# Altium schematic sheet 2126_A_MainBoard_AffichageMatriciel.SchDoc
size A3; Author: Ricardo Crespo; Organization: ETML-ES; Address1: Avenue Recordon 1; Address2: 1004 Lausanne; Address3: Switzerland; Revision: A; SheetNumber: 1; SheetTotal: 1
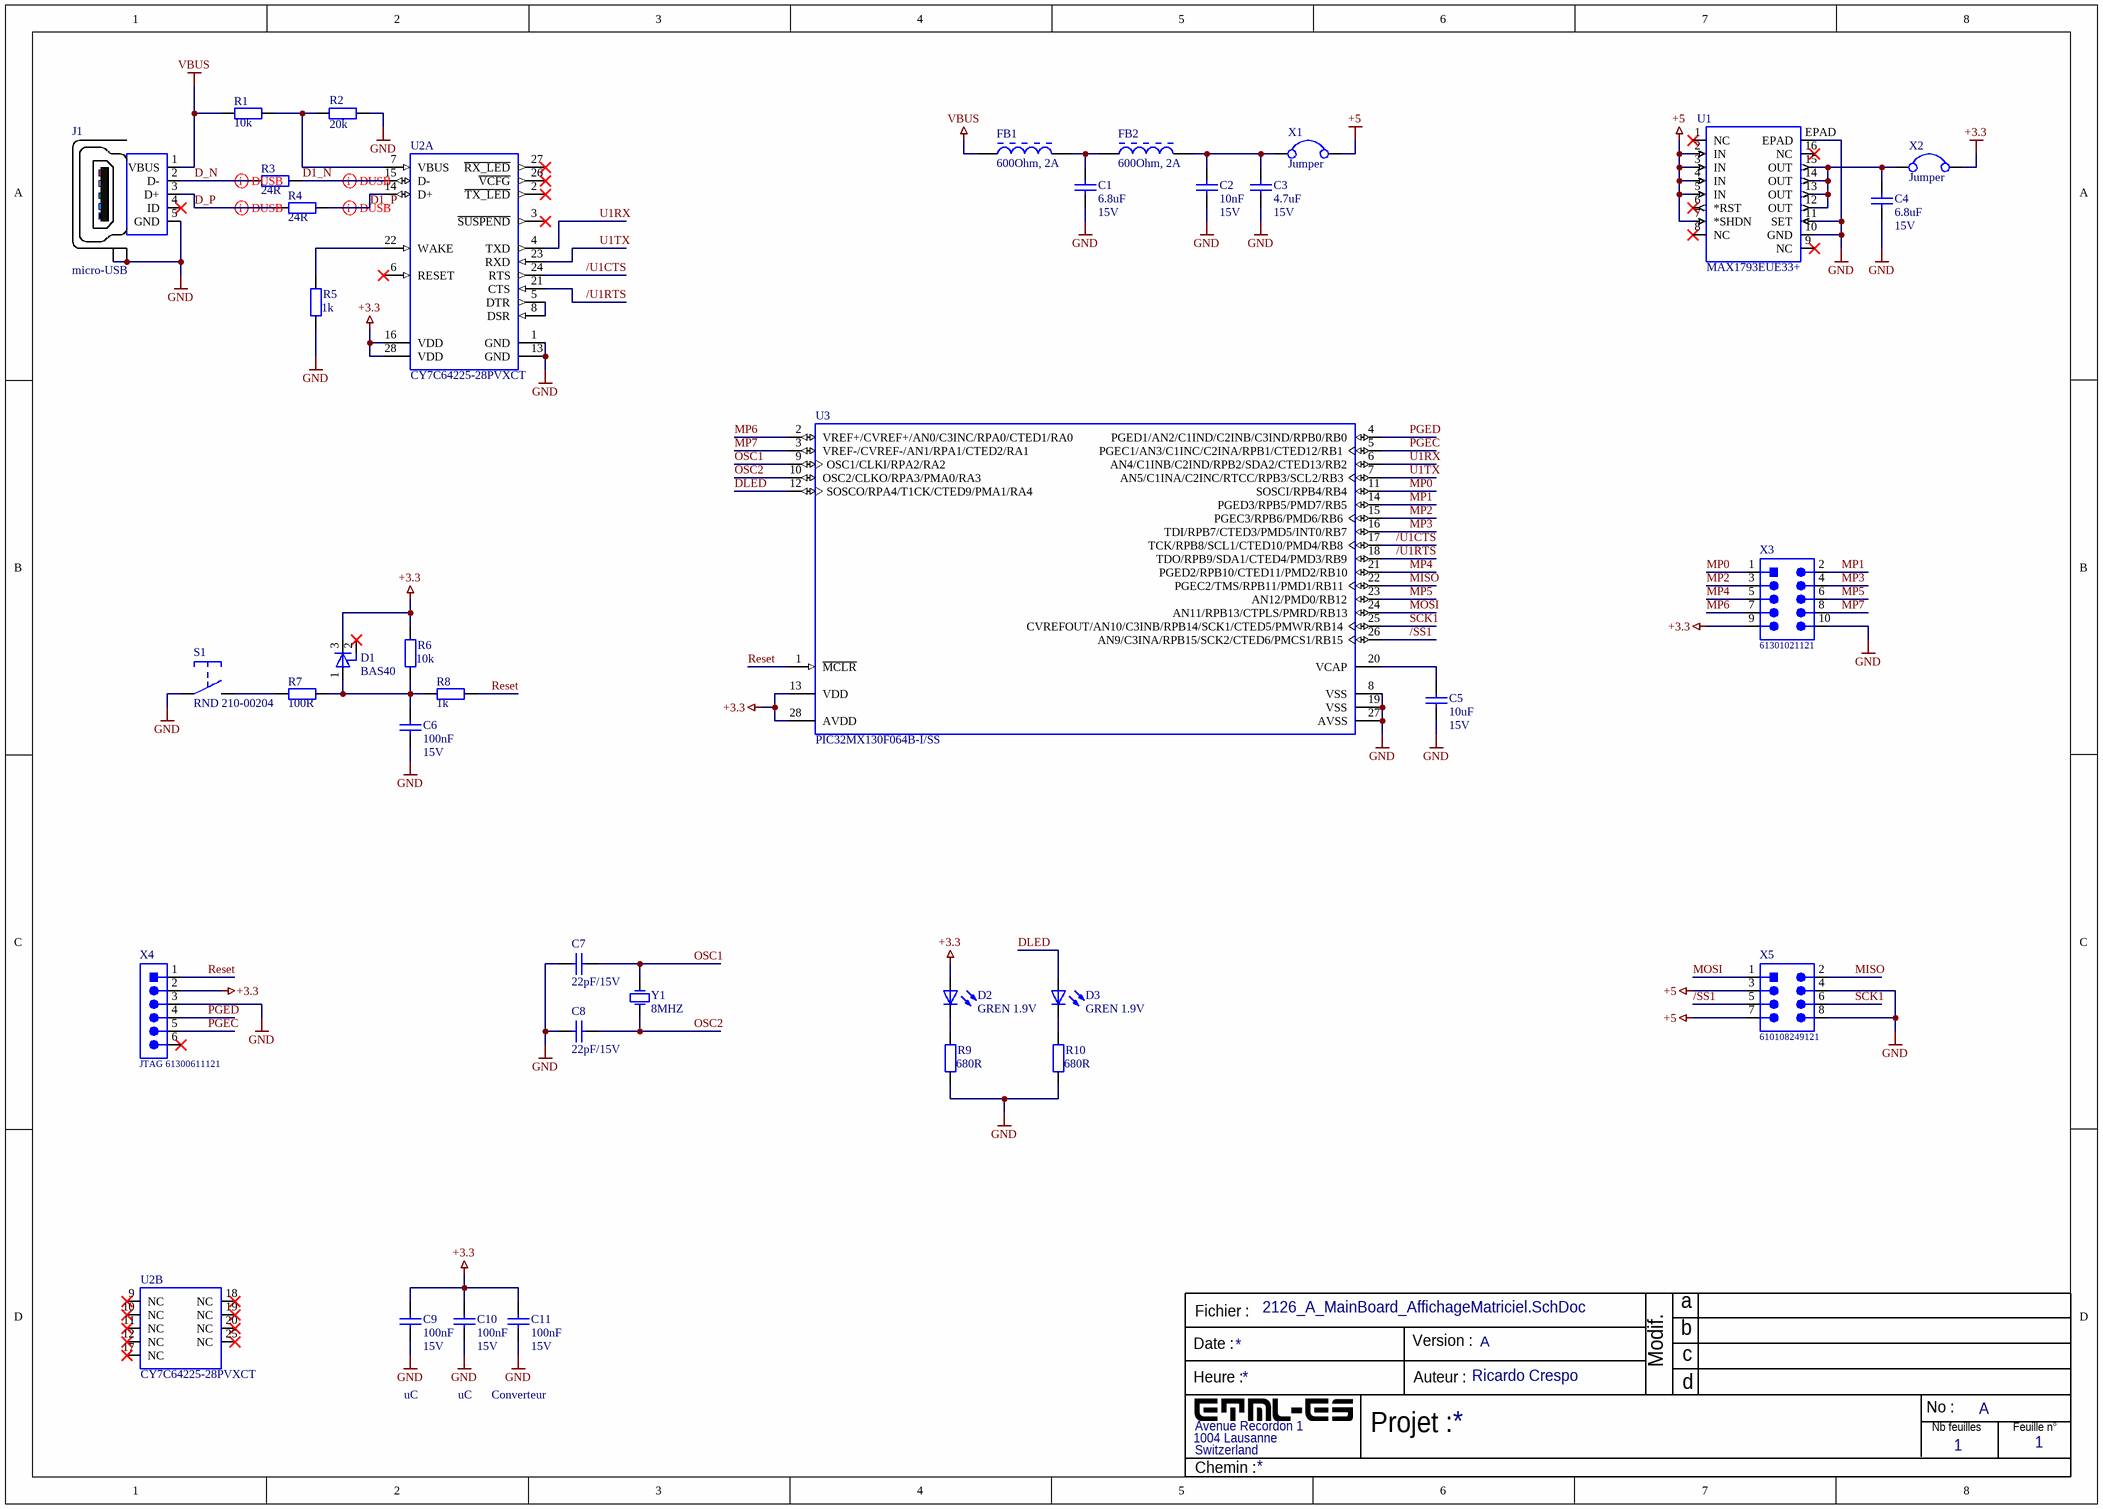
[diagram p0: 2126_A_MainBoard_AffichageMatriciel.SchDoc]

## Parts
C1  6.8uF  [CAPC2013X145X48NL20T23]
C2  10nF  [CAPC2013X145X48NL20T23]
C3  4.7uF  [CAPC2013X145X48NL20T23]
C4  6.8uF  [CAPC2013X145X48NL20T23]
C5  10uF  [CAPC2013X145X48NL20T23]
C6  100nF  [CAPC2013X145X48NL20T23]
C7  22pF/15V  [CAPC2013X145X48NL20T23]
C8  22pF/15V  [CAPC2013X145X48NL20T23]
C9  100nF  [CAPC2013X145X48NL20T23]
C10  100nF  [CAPC2013X145X48NL20T23]
C11  100nF  [CAPC2013X145X48NL20T23]
D1  BAS40  [INF-SOT23_N]
D2  GREN 1.9V  [LED_0805]
D3  GREN 1.9V  [LED_0805]
FB1  600Ohm, 2A  [WE-CBF_1206_High Speed]
FB2  600Ohm, 2A  [WE-CBF_1206_High Speed]
J1  micro-USB  [629105150521]
R1  10k  [RESC2013X70X40ML20T20]
R2  20k  [RESC2013X70X40ML20T20]
R3  24R  [RESC2013X70X40ML20T20]
R4  24R  [RESC2013X70X40ML20T20]
R5  1k  [RESC2013X70X40ML20T20]
R6  10k  [RESC2013X70X40ML20T20]
R7  100R  [RESC2013X70X40ML20T20]
R8  1k  [RESC2013X70X40ML20T20]
R9  680R  [RESC2013X70X40ML20T20]
R10  680R  [RESC2013X70X40ML20T20]
S1  RND 210-00204  [PushButton]
U1  MAX1793EUE33+  [TSOP65P640X110_HS-17N]
U2  CY7C64225-28PVXCT  [CYP-PVX28_N]  (parts A,B of 2)
U3  PIC32MX130F064B-I/SS  [MCHP-SSOP-SS28_N]
X1  Jumper  [61300211121]
X2  Jumper  [61300211121]
X3  61301021121  [61301021121]
X4  JTAG 61300611121  [61300611121]
X5  610108249121  [610108249121]
Y1  8MHZ  [LFXTAL003151REEL]

## Nets
+3.3: C9.2 C10.2 C11.2 D1.3(K) D2.A R6.2 U2.16(VDD) U2.28(VDD) U3.13(VDD) U3.28(AVDD) X2.2 X3.9 X4.2
+5: U1.2(IN) U1.3(IN) U1.4(IN) U1.5(IN) U1.7(*SHDN) X1.2 X5.3 X5.7
GND: C1.1 C2.1 C3.1 C4.1 C5.1 C6.1 C7.1 C8.1 C9.1 C10.1 C11.1 J1.5(GND) J1.Z1(Shield) J1.Z2(Shield) R2.1 R5.1 R9.1 R10.1 S1.1 U1.10(GND) U1.11(SET) U1.EPAD U2.1(GND) U2.13(GND) U3.8(VSS) U3.19(VSS) U3.27(AVSS) X3.10 X4.3 X5.4 X5.8
VBUS: FB1.1 J1.1(VBUS) R1.1
/SS1: U3.26(AN9/C3INA/RPB15/SCK2/CTED6/PMCS1/RB15) X5.5
/U1CTS: U2.24(RTS) U3.17(TCK/RPB8/SCL1/CTED10/PMD4/RB8)
/U1RTS: U2.21(CTS) U3.18(TDO/RPB9/SDA1/CTED4/PMD3/RB9)
D1_N: R3.2 U2.15(D-)
D1_P: R4.2 U2.14(D+)
D_N: J1.2(D-) R3.1
D_P: J1.3(D+) R4.1
DLED: D3.A U3.12(SOSCO/RPA4/T1CK/CTED9/PMA1/RA4)
MISO: U3.22(PGEC2/TMS/RPB11/PMD1/RB11) X5.2
MOSI: U3.24(AN11/RPB13/CTPLS/PMRD/RB13) X5.1
MP0: U3.11(SOSCI/RPB4/RB4) X3.1
MP1: U3.14(PGED3/RPB5/PMD7/RB5) X3.2
MP2: U3.15(PGEC3/RPB6/PMD6/RB6) X3.3
MP3: U3.16(TDI/RPB7/CTED3/PMD5/INT0/RB7) X3.4
MP4: U3.21(PGED2/RPB10/CTED11/PMD2/RB10) X3.5
MP5: U3.23(AN12/PMD0/RB12) X3.6
MP6: U3.2(VREF+/CVREF+/AN0/C3INC/RPA0/CTED1/RA0) X3.7
MP7: U3.3(VREF-/CVREF-/AN1/RPA1/CTED2/RA1) X3.8
OSC1: C7.2 U3.9(OSC1/CLKI/RPA2/RA2) Y1.1
OSC2: C8.2 U3.10(OSC2/CLKO/RPA3/PMA0/RA3) Y1.2
PGEC: U3.5(PGEC1/AN3/C1INC/C2INA/RPB1/CTED12/RB1) X4.5
PGED: U3.4(PGED1/AN2/C1IND/C2INB/C3IND/RPB0/RB0) X4.4
Reset: R8.2 U3.1(~{MCLR}) X4.1
SCK1: U3.25(CVREFOUT/AN10/C3INB/RPB14/SCK1/CTED5/PMWR/RB14) X5.6
U1RX: U2.4(TXD) U3.6(AN4/C1INB/C2IND/RPB2/SDA2/CTED13/RB2)
U1TX: U2.23(RXD) U3.7(AN5/C1INA/C2INC/RTCC/RPB3/SCL2/RB3)
NetC1_2: C1.2 FB1.2 FB2.1
NetC2_2: C2.2 C3.2 FB2.2 X1.1
NetC4_2: C4.2 U1.12(OUT) U1.13(OUT) U1.14(OUT) U1.15(OUT) X2.1
NetC5_2: C5.2 U3.20(VCAP)
NetC6_2: C6.2 D1.1(A) R6.1 R7.2 R8.1
NetD2_K: D2.K R9.2
NetD3_K: D3.K R10.2
NetR1_2: R1.2 R2.2 U2.7(VBUS)
NetR5_2: R5.2 U2.22(WAKE)
NetR7_1: R7.1 S1.2
NetU2_5: U2.5(DTR) U2.8(DSR)

Not connected (* = marked no-connect by the designer): D1 2(NC)*; J1 4(ID)*; U1 1(NC)* 6(*RST)* 8(NC)* 9(NC)* 16(NC)*; U2 2(~{TX_LED})* 3(~{SUSPEND})* 6(RESET)* 9(NC)* 10(NC)* 11(NC)* 12(NC)* 17(NC)* 18(NC)* 19(NC)* 20(NC)* 25(NC)* 26(~{VCFG})* 27(~{RX_LED})*; X4 6*

## Layout directives
differential pair; differential pair class USB: D1_N, D1_P, D_N, D_P

## Notes on the sheet
- (near C1) 15V
- 15V
- (near C3) 15V
- (near C4) 15V
- (near C6) 15V
- (near C5) 15V
- uC
- Converteur
- (near C11) 15V
- A
- Fichier :
- a
- Date :
- Heure :
- Version :
- Auteur :
- Modif.
- b
- c
- d
- Projet :
- No :
- Nb feuilles
- Feuille n°
- Chemin :

## Library data of the parts
C1-C11 = CMP-2007-03167-1: VJ0805Y104KNAAT; Manufacturer: Vitramon; Manufacturer 1: Vishay Vitramon; Part Number: VJ0805Y104KNAAT; Manufacturer Part Number 1: VJ0805Y104KNAAT
D1 = CMP-1182-00023-1: Silicon Schottky Diode, -55 to 150 degC, SOT23, Reel, Green; Manufacturer: Infineon; IF (max): 120Â mA; Configuration: Single; VR (max): 40Â V; Green: TRUE; VF (max): 1,000Â mV; CT (max): 5Â pF; PackageDescription: 3-Pin Small Outline Transistor Package, 1.3 x 2.9 mm Body, 0.95 mm Pitch; ComponentLink3Description: Package Specification; Mounting Technology: Surface Mount; PackageVersion: Apr-08; ComponentLink1Description: Manufacturer URL; ComponentLink1URL: http://www.infineon.com/; ComponentLink2URL: http://www.infineon.com/dgdl/bas40_bas140series.pdf?folderId=db3a30431400ef68011425f1ca2505e3&fileId=db3a304314dca389011518a57ed20e11; PartNumber: BAS40; ComponentLink2Description: Datasheet; PackageReference: SOT23; ComponentLink3URL: http://www.infineon.com/dgdl/SOT23-Package_Overview.pdf?folderId=db3a30431936bc4b0119532290053c66&fileId=db3a30431936bc4b0119533468123c85; Packing: Reel
D2 D3 = 151031VS04000_G: WL-TMRC THT Mono-color Round Color, size 3mm, Bright Green, 2.1V, 40deg; Luminous Intensity: 120mcd; Dominant Wavelength: 570nm; Peak Wavelength: 573nm; Chip Technology: AlInGaP; ComponentLink1Description: Manufacturer; ComponentLink1URL: http://www.we-online.de; ComponentLink2Description: Datasheet; ComponentLink2URL: https://katalog.we-online.de/led/datasheet/151031VS04000.pdf; Emitting Color: Bright Green; Operating Temperature: -40 to +85degC; Mounting Technology: THT; Forward Voltage: 2.1V; Part Number: 151031VS04000; Packaging: Bulk; Published Date: January 2021; Publisher: Wurth Elektronik; Size: 3mm; Viewing Angle: 40deg
FB1 FB2 = 74279218: WE-CBF SMT EMI Suppression Ferrite Bead, size 1206, 600Ohm, 2A; Manufacturer: Wurth Elektronik; Impedance max.: 700Ohm; DC Resistance max.: 0.1Ohm; Type: High Current; ComponentLink1Description: Manufacturer; ComponentLink1URL: http://www.we-online.de; ComponentLink2Description: Datasheet; ComponentLink2URL: https://www.we-online.com/catalog/datasheet/74279218.pdf; Operating Temperature: -55 to +125degC; Packaging: Tape and Reel; Published Date: March 2020; Rated Current: 2A; Manufacturer Part Number: 74279218; Impedance @100MHz: 600Ohm; Mounting Technology: SMT; Size: 1206
J1 = WR-Communication Connectors 629105150521: WR-COM_USB_Micro Type B_Horizontal_SMT; Manufacturer: Würth Elektronik eiSos GmbH; ComponentLink1 Description: Manufacturer; ComponentLink2 Description: Datasheet; NoPins: 5; ComponentLink1URL: http://www.we-online.de; ComponentLink2URL: http://katalog.we-online.de/em/datasheet/629105150521.pdf; Created by: Karrer Zheng; Created Date: 10/21/2014; partNo: 629105150521; Supplier: Digikey; Supplier Ref.: 732-5960-1-ND; Supplier min. qty: 1; Supplier unit price: 2.03
R1-R10 = CMP-1013-00623-1: 10K 0.125W 1% 0805 (2012 Metric)  SMD; Manufacturer 1: Vishay Dale; Manufacturer Part Number 1: CRCW080510K0FKEC; Manufacturer 10: Panasonic; Manufacturer Part Number 10: ERJ-6ENF1002V; Case-Metric: 2012; Case-EIA: 0805; Tolerance: 1 %; Technology: SMT; Supplier 1: Digi-Key; Supplier Part Number 1: 541-10.0KCCT-ND; Manufacturer 2: Yageo; Manufacturer Part Number 2: RC0805FR-0710KL; Manufacturer 3: Vishay Dale; Manufacturer Part Number 3: CRCW080510K0FKTC; Manufacturer 4: Vishay Dale; Manufacturer Part Number 4: CRCW080510K0FKEB; Manufacturer 5: Bourns; Manufacturer Part Number 5: CR0805-FX-1002ELF; Manufacturer 6: Rohm; Manufacturer Part Number 6: MCR10EZPF1002; Manufacturer 7: Vishay; Manufacturer Part Number 7: CRCW080510K0FKEA; Manufacturer 8: Vishay Dale; Manufacturer Part Number 8: CRCW080510K0FKTB; Manufacturer 9: Vishay Dale; Manufacturer Part Number 9: CRCW080510K0FKTA; Value: 10k; Power: 0.125 W
S1 = PushBtn
U1 = MAX1793EUE33+: No Description Available; Mfr_Name: Maxim Integrated Products; Copyright: Copyright (C) 2021 Ultra Librarian. All rights reserved.; Manufacturer_Part_Number: MAX1793EUE33+; RefDes: RefDes; Type: DEV
U2 = CY7C64225-28PVXCT: USB-to-UART Bridge Controller, 3 to 5.25 V, 0 to 70 degC, 28-Pin SSOP (PVX28), Tape and Reel; Manufacturer: Cypress; Min. Operating Voltage (V): 3; Max. Operating Voltage (V): 5.25; Memory Architecture: Flash; ComponentLink1Description: Manufacturer URL; ComponentLink2Description: Datasheet; DatasheetVersion: Rev. *D; ComponentLink3URL: http://www.cypress.com/?docID=1371; ComponentLink3Description: Package Specification; ComponentLink1URL: http://www.cypress.com/; ComponentLink2URL: http://www.cypress.com/?docID=48153; Min. Operating Temp. (degreesC): 0; Packing: Tape and Reel; PackageVersion: Rev. *C, 10/2001; PartNumber: CY7C64225-28PVXCT; Max. Operating Temp. (degreesC): 70; PackageDescription: 28-Pin Super Small Outline Package, Body 10.2 x 5.3 mm, Pitch 0.65 mm; Mounting Technology: Surface Mount; RoHS: Pb-Free; PackageReference: PVX28
U3 = PIC32MX130F064B-I/SS: 32-bit Microcontroller with Audio and Graphics Interface, USB and Advanced Analog, 40 MHz, 21 I/O, PMP, -40 to 85 degC, 28-pin SSOP (SS28), Tube; Manufacturer: Microchip; ComponentLink1Description: Manufacturer URL; ComponentLink2Description: Datasheet; DatasheetVersion: Rev. E; Mounting Technology: Surface Mount; ComponentLink3URL: http://www.microchip.com/stellent/groups/techpub_sg/documents/packagingspec/en012702.pdf; ComponentLink3Description: Package Specification; ComponentLink1URL: http://www.microchip.com; ComponentLink2URL: http://ww1.microchip.com/downloads/en/DeviceDoc/61168E.pdf; ComponentLink4Description: Product URL; PartNumber: PIC32MX130F064B-I/SS; ComponentLink4URL: http://www.microchip.com/PIC32MX130F064B; PackageDescription: 28-Lead Plastic Shrink Small Outline, 10.2 x 5.3 mm Body, 0.65 mm Pitch; PackageVersion: C04-073B; PackageReference: SSOP-SS28
X3 = 61301021121: WR-PHD Pin Header, THT, pitch 2.54mm, Dual Row, Vertical, 10p; Manufacturer: Wurth Elektronik; Pin Number: 10; Rated Current: 3A; Working Voltage: 250VAC; Withstanding Voltage: 500VAC; Contact Resistance: 20mOhm; ComponentLink1Description: Manufacturer; ComponentLink1URL: http://www.we-online.de; ComponentLink2Description: Datasheet; ComponentLink2URL: https://www.we-online.com/catalog/datasheet/61301021121.pdf; Manufacturer Part Number: 61301021121; Pitch: 2.54mm; Operating Temperature: -40 to +105degC; Mounting Technology: THT; Packaging: Bag; Gender: Pin Header; Row Number: Dual; Orientation: Vertical
X4 = JTAG 61300611121: WR-PHD Pin Header, THT, pitch 2.54mm, Single Row, Vertical, 6p; Manufacturer: Wurth Elektronik; Pin Number: 6; Rated Current: 3A; Working Voltage: 250VAC; Withstanding Voltage: 500VAC; Contact Resistance: 20mOhm; ComponentLink1Description: Manufacturer; ComponentLink1URL: http://www.we-online.de; ComponentLink2Description: Datasheet; ComponentLink2URL: https://www.we-online.com/catalog/datasheet/61300611121.pdf; Manufacturer Part Number: 61300611121; Pitch: 2.54mm; Operating Temperature: -40 to +105degC; Mounting Technology: THT; Packaging: Bag; Gender: Pin Header; Row Number: Single; Orientation: Vertical
X5 = 610108249121: WR-PHD Pin Header, THT, pitch 2.54mm, Dual Row, Angled, 8p; Manufacturer Part Number: 61300821021; Manufacturer: Wurth Elektronik; Pin Number: 8; Rated Current: 3A; Working Voltage: 250VAC; Withstanding Voltage: 500VAC; Contact Resistance: 20mOhm; ComponentLink1Description: Manufacturer; ComponentLink1URL: http://www.we-online.de; ComponentLink2Description: Datasheet; ComponentLink2URL: https://www.we-online.com/catalog/datasheet/61300821021.pdf; Pitch: 2.54mm; Operating Temperature: -40 to +105degC; Mounting Technology: THT; Packaging: Bag; Gender: Pin Header; Row Number: Dual; Orientation: Angled
Y1 = LFXTAL003151REEL: Crystal or Oscillator; Manufacturer_Name: IQD; Datasheet Link: https://componentsearchengine.com//LFXTAL003151Reel.pdf; Height: 4.3mm; Mouser2 Part Number: 449-LFXTAL003151REEL; Mouser2 Price/Stock: https://www.mouser.com/Search/Refine.aspx?Keyword=449-LFXTAL003151REEL; Manufacturer_Part_Number: LFXTAL003151REEL